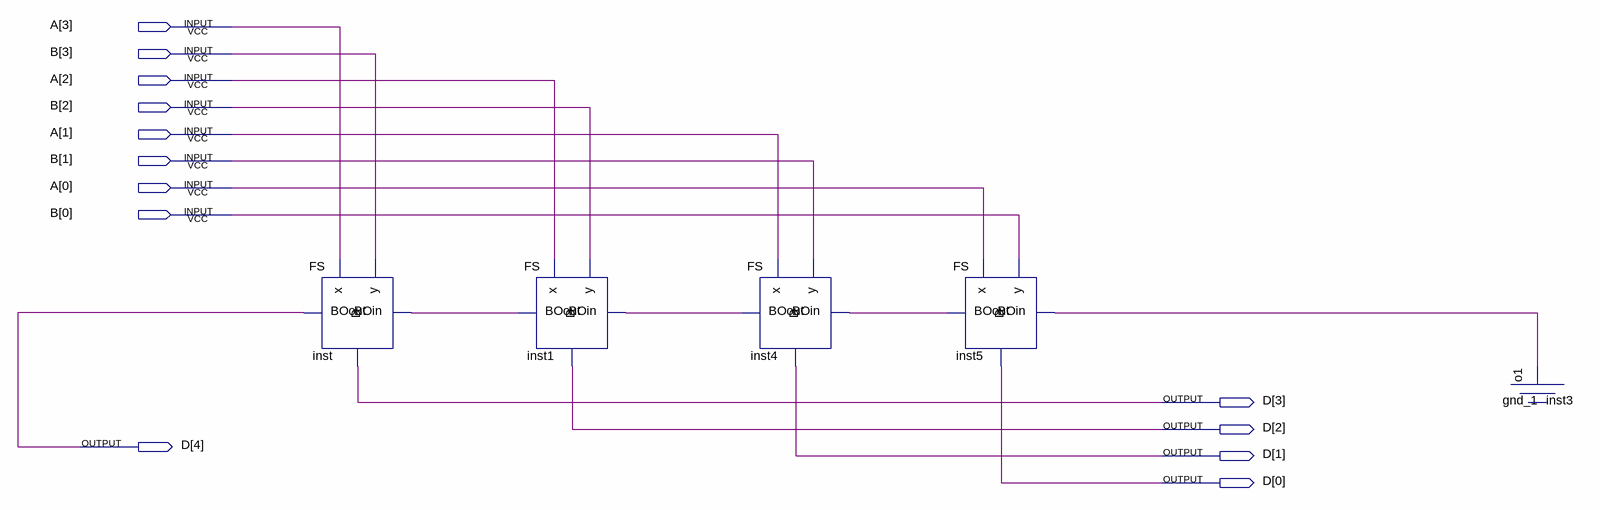
[diagram p0: schematic sheet]
// Quartus schematic FS4.bdf as structural Verilog: 5 symbols, 13 pins
module FS4 (
  input  [3:0] A,
  input  [3:0] B,
  output [4:0] D
);

  wire inst1_boout, inst3_o1, inst4_boout, inst5_boout;

  FS inst (.x(A[3]), .y(B[3]), .BOin(inst1_boout), .BOout(D[4]), .D(D[3]));
  FS inst1 (.x(A[2]), .y(B[2]), .BOin(inst4_boout), .BOout(inst1_boout), .D(D[2]));
  FS inst4 (.x(A[1]), .y(B[1]), .BOin(inst5_boout), .BOout(inst4_boout), .D(D[1]));
  FS inst5 (.x(A[0]), .y(B[0]), .BOin(inst3_o1), .BOout(inst5_boout), .D(D[0]));
  gnd_1 inst3 (.o1(inst3_o1));
endmodule
